# EAGLE design dmx (EAGLE 5.09)
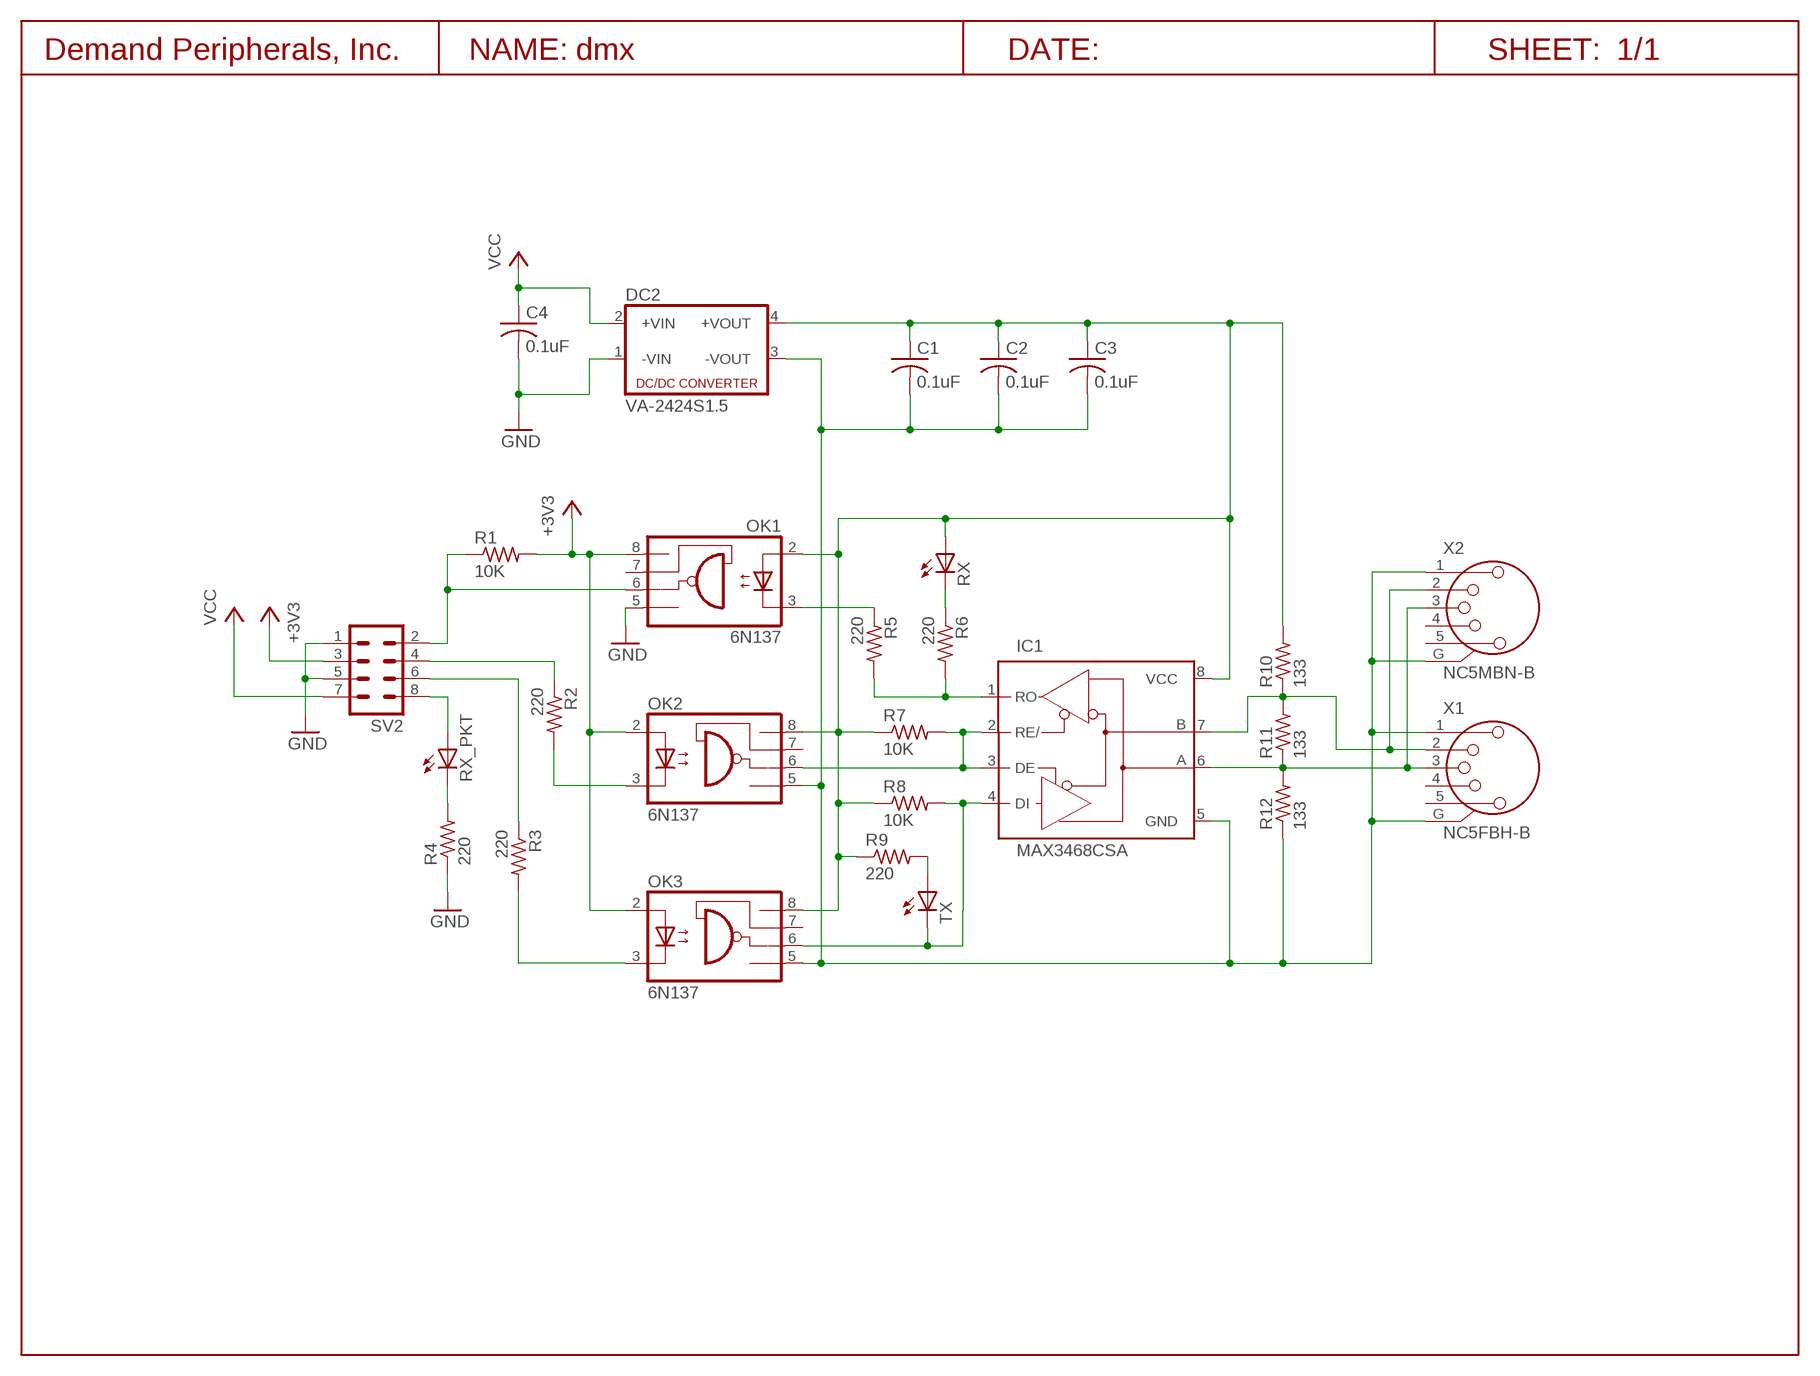
[diagram p0: schematic, sheet 1]

## Parts
C1  0.1uF  C-USC0805  [C0805]
C2  0.1uF  C-USC0805  [C0805]
C3  0.1uF  C-USC0805  [C0805]
C4  0.1uF  C-USC0805  [C0805]
DC2  VA-2424S1.5  [4SIL]
IC1  MAX3468CSA  [SO08]
OK1  6N137  HCPL0600  [SOIC08]
OK2  6N137  HCPL0600  [SOIC08]
OK3  6N137  HCPL0600  [SOIC08]
R1  10K  R-US_R0603  [R0603]
R2  220  R-US_R0603  [R0603]
R3  220  R-US_R0603  [R0603]
R4  220  R-US_R0603  [R0603]
R5  220  R-US_R0603  [R0603]
R6  220  R-US_R0603  [R0603]
R7  10K  R-US_R0603  [R0603]
R8  10K  R-US_R0603  [R0603]
R9  220  R-US_R0603  [R0603]
R10  133  R-US_R0603  [R0603]
R11  133  R-US_R0603  [R0603]
R12  133  R-US_R0603  [R0603]
RX  LEDCHIPLED_0805  [CHIPLED_0805]
RX_PKT  LEDCHIPLED_0805  [CHIPLED_0805]
SV2  MA04-2  [MA04-2]
TX  LEDCHIPLED_0805  [CHIPLED_0805]
U$1  DP_FRAME_L  [LETTER_L]
X1  NC5FBH-B  [NC5FBH-B]
X2  NC5MBN-B  [NC5MBH-B]

## Nets
+3V3: OK1.8(VCC) OK2.2(A) OK3.2(A) R1.2 SV2.3
GND: C4.2 DC2.1(-VIN) OK1.5(GND) R4.1 SV2.1 SV2.5
N$1: OK1.6(VO) R1.1 SV2.2
N$2: OK2.3(C) R2.2
N$3: R2.1 SV2.4
N$4: OK3.3(C) R3.2
N$5: IC1.1(RO) R5.2 R6.2
N$6: C1.1 C2.1 C3.1 DC2.4(+VOUT) IC1.8(VCC) OK1.2(A) OK2.8(VCC) OK3.8(VCC) R7.1 R8.1 R9.1 R10.2 RX.A
N$7: C1.2 C2.2 C3.2 DC2.3(-VOUT) IC1.5(GND) OK2.5(GND) OK3.5(GND) R12.1
N$8: IC1.2(RE/) IC1.3(DE) OK2.6(VO) R7.2
N$9: R6.1 RX.C
N$10: OK1.3(C) R5.1
N$11: R9.2 TX.A
N$13: IC1.4(DI) OK3.6(VO) R8.2 TX.C
N$14: IC1.7(B) R10.1 R11.2 X1.2 X2.2
N$15: IC1.6(A) R11.1 R12.2 X1.3 X2.3
N$16: R3.1 SV2.6
N$21: R4.2 RX_PKT.C
N$28: RX_PKT.A SV2.8
N$29: X1.1 X1.G X2.1 X2.G
VCC: C4.1 DC2.2(+VIN) SV2.7
Unconnected: OK1.7(VE) OK2.7(VE) OK3.7(VE) X1.4 X1.5 X2.4 X2.5

## Library data of the parts
C1-C4 = rcl:C-US: CAPACITOR, American symbol
DC2 = dc-dc-converter:VA-*?: DC DC Converter Single Output, 1 Watt Motien Technology Co.,Ltd. Source: va-serie.pdf
IC1 = maxim:MAX34*: +5V, Fail-Safe, 40Mbps, Profibus RS-485/RS-422 Transceivers Source: MAX3465-MAX3469.pdf
OK1-OK3 = optocoupler:HCPL0600: HEWLETT PACKARD OPTO COUPLER
R1-R12 = rcl:R-US_: RESISTOR, American symbol
RX RX_PKT TX = led:LED: LED OSRAM: - CHIPLED LG R971, LG N971, LY N971, LG Q971, LY Q971, LO R971, LY R971 LH N974, LH R974 LS Q976, LO Q976, LY Q976 LO Q996 - Hyper CHIPLED LW Q18S LB Q993, LB Q99A, LB R99A - SideLED LS A670, LO A670, LY A670, LG A670, LP A670 LB A673, LV A673, LT A673, LW A673 LH A674 LY A675 LS A676, LA A676, LO A676, LY A676, LW A676 LS A679, LY A679, LG A679 - Hyper Micro SIDELED® LS Y876, LA Y876, LO Y876, LY Y876 LT Y87S - SmartLED LW L88C, LW L88S LB L89C, LB L89S, LG L890 LS L89K, LO L89K, LY L89K LS L896, LA L896, LO L896, LY L896 - TOPLED LS T670, LO T670, LY T670, LG T670, LP T670 LSG T670, LSP T670, LSY T670, LOP T670, LYG T670 LG T671, LOG T671, LSG T671 LB T673, LV T673, LT T673, LW T673 LH T674 LS T676, LA T676, LO T676, LY T676, LB T676, LH T676, LSB T676, LW T676 LB T67C, LV T67C, LT T67C, LS T67K, LO T67K, LY T67K, LW E67C LS E67B, LA E67B, LO E67B, LY E67B, LB E67C, LV E67C, LT E67C LW T67C LS T679, LY T679, LG T679 LS T770, LO T770, LY T770, LG T770, LP T770 LB T773, LV T773, LT T773, LW T773 LH T774 LS E675, LA E675, LY E675, LS T675 LS T776, LA T776, LO T776, LY T776, LB T776 LHGB T686 LT T68C, LB T68C - Hyper Mini TOPLED® LB M676 - Mini TOPLED Santana® LG M470 LS M47K, LO M47K, LY M47K Source: http://www.osram.convergy.de LUXEON: - LUMILED® LXK2-PW12-R00, LXK2-PW12-S00, LXK2-PW14-U00, LXK2-PW14-V00 LXK2-PM12-R00, LXK2-PM12-S00, LXK2-PM14-U00 LXK2-PE12-Q00, LXK2-PE12-R00, LXK2-PE12-S00, LXK2-PE14-T00, LXK2-PE14-U00 LXK2-PB12-K00, LXK2-PB12-L00, LXK2-PB12-M00, LXK2-PB14-N00, LXK2-PB14-P00, LXK2-PB14-Q00 LXK2-PR12-L00, LXK2-PR12-M00, LXK2-PR14-Q00, LXK2-PR14-R00 LXK2-PD12-Q00, LXK2-PD12-R00, LXK2-PD12-S00 LXK2-PH12-R00, LXK2-PH12-S00 LXK2-PL12-P00, LXK2-PL12-Q00, LXK2-PL12-R00 Source: www.luxeon.com KINGBRIGHT: KA-3528ASYC Source: www.kingbright.com
SV2 = con-lstb:MA04-2: PIN HEADER
U$1 = DP:DP_FRAME_L: Landscape/Letter Document Frame
X1 X2 = con-neutrik_ag:NC5: Neutrik Audio Connector XLR SERIES Stereo 1/4" jack Source: www.neutrik.com/

## Board
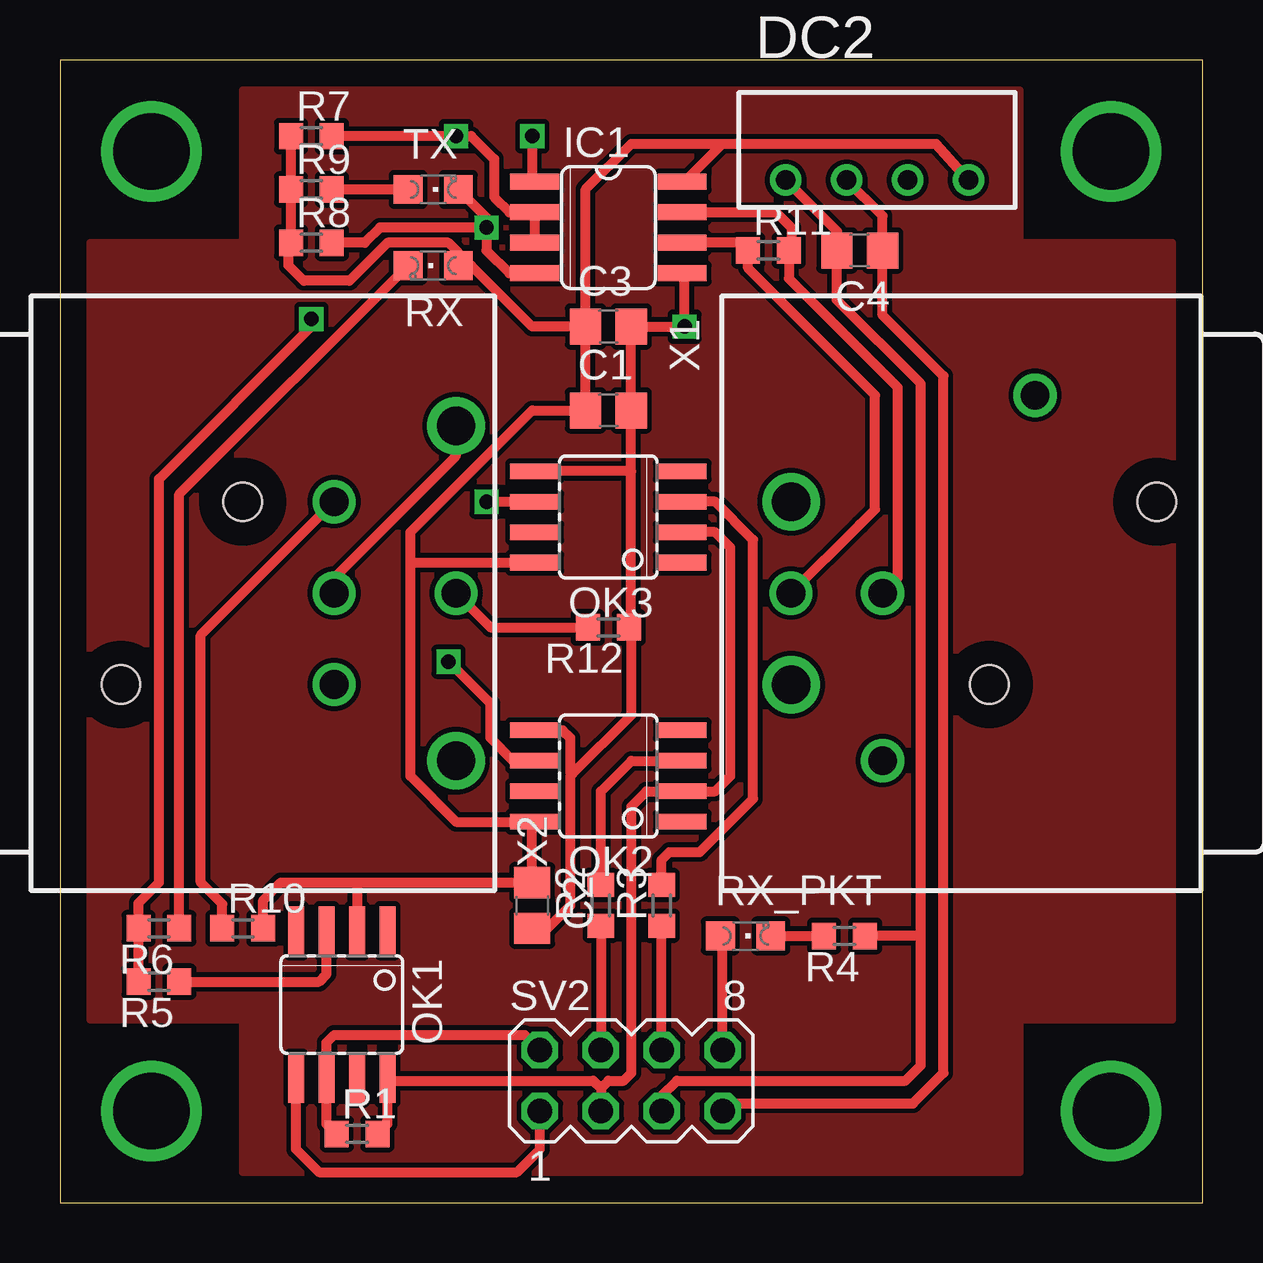
[diagram p1: board, top side]
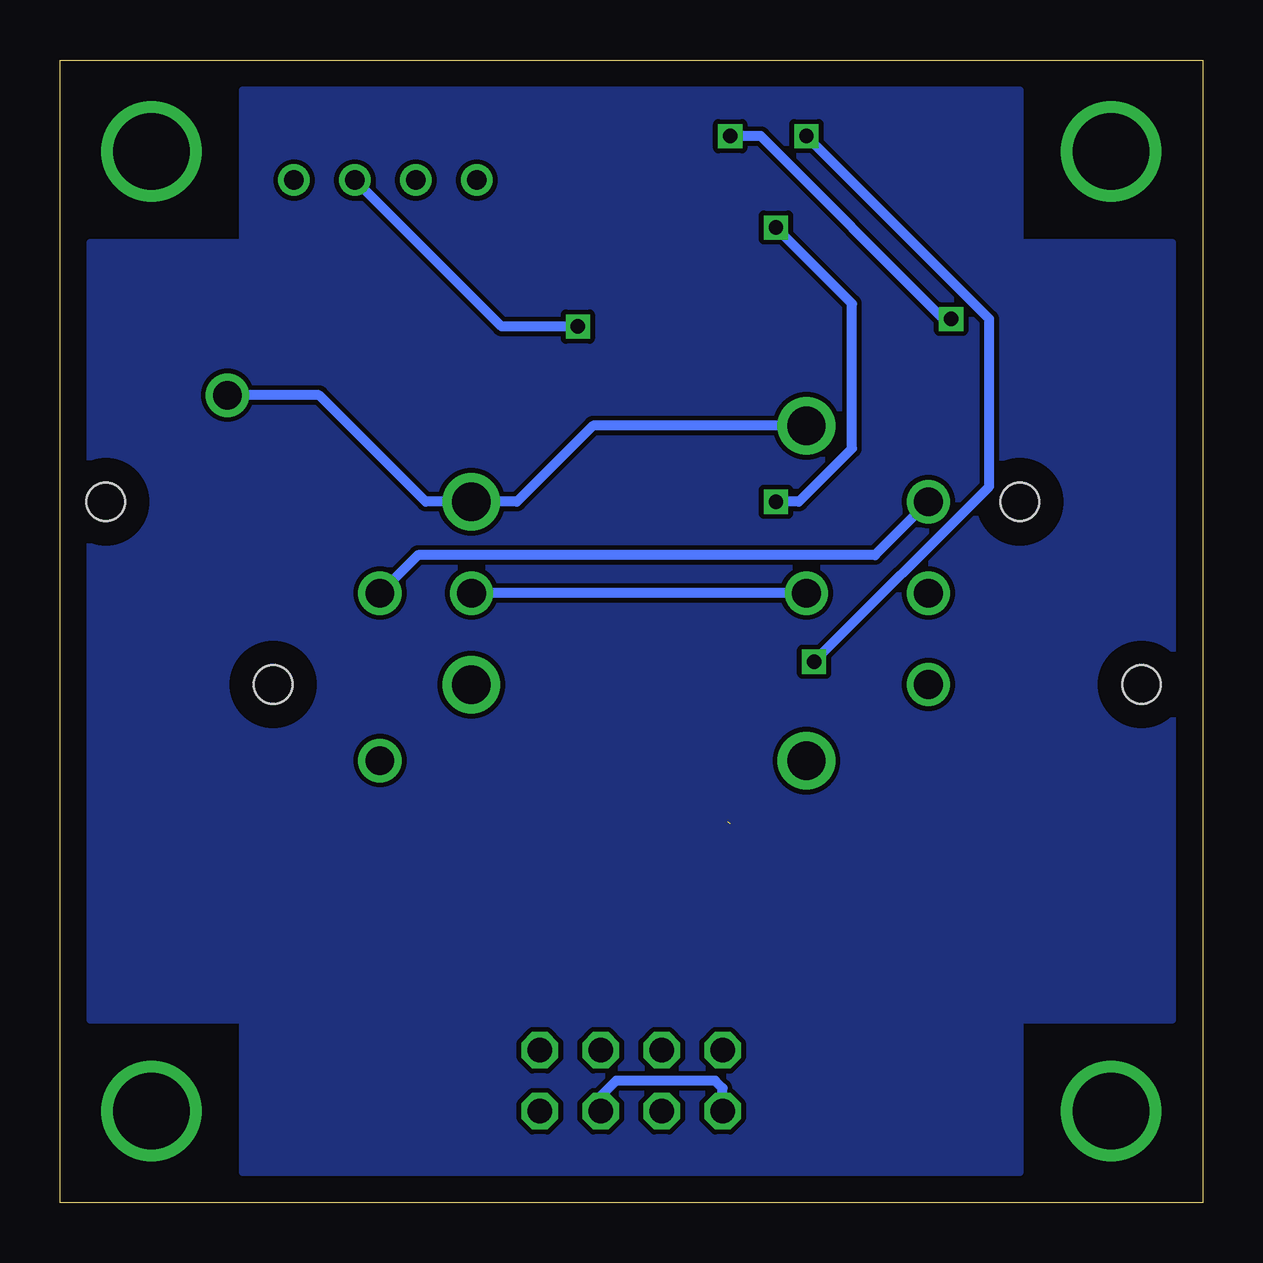
[diagram p2: board, bottom side, seen from below]

Size 47.62 x 47.62 mm. Coordinates in mm from the lower left corner, seen from the top.
Outline: 0,0 47.62,0 47.62,47.62 0,47.62 0,0
Copper layers (1*16): Top 0.035mm / dielectric 1.5mm / Bottom 0.035mm
Design rules "default": minimum track width 10mil, minimum drill 24mil, track to track 8mil, track to pad 8mil, pad to pad 8mil, via to via 8mil, smd to smd 8mil, copper to edge 40mil, drill to drill 8mil, minimum pad ring 10mil, minimum via ring 8mil, stop-mask expansion 4mil, vias tented up to drill 0mil, thermal gap 10mil
tKeepout: area 15.1,0.5 to 32.5,9.7

### Footprints (pad centres in the part's own frame; a part is rotated, then mirrored left to right if it is on the bottom)
C0805 = smd 1.3 x 1.5: 1 -0.95,0; 2 0.95,0
4SIL = drill 0.8 round: 1 -3.81,0; 2 -1.27,0; 3 1.27,0; 4 3.81,0
SO08 = smd 0.66 x 2.032: 1 -1.905,-3.073; 2 -0.635,-3.073; 3 0.635,-3.073; 4 1.905,-3.073; 5 1.905,3.073; 6 0.635,3.073; 7 -0.635,3.073; 8 -1.905,3.073
SOIC08 = smd 0.66 x 2.032: 1 -1.905,-3.073; 2 -0.635,-3.073; 3 0.635,-3.073; 4 1.905,-3.073; 5 1.905,3.073; 6 0.635,3.073; 7 -0.635,3.073; 8 -1.905,3.073
R0603 = smd 1 x 1.1: 1 -0.85,0; 2 0.85,0
CHIPLED_0805 = smd 1.2 x 1.2: A 0,-1.05; C 0,1.05
MA04-2 = drill 1.016 octagon: 1 -3.81,-1.27; 2 -3.81,1.27; 3 -1.27,-1.27; 4 -1.27,1.27; 5 1.27,-1.27; 6 1.27,1.27; 7 3.81,-1.27; 8 3.81,1.27
NC5FBH-B = drill 1.6 round: 1 -3.81,-3.815; 5 3.81,-3.815 | drill 1.2 round: 2 0,0; 3 0,-3.815; 4 6.98,0; G -8.25,6.355 | hole 1.6: 3.81,4.445; -3.81,11.43
NC5MBH-B = drill 1.6 round: 1 6.98,-5.08; 5 -6.98,-5.08 | drill 1.2 round: 2 3.81,0; 3 0,-5.08; 4 -3.81,0; G 0,0 | hole 1.6: 3.81,3.81; -3.81,8.89

### Placement (x,y rotation side)
C1  22.86,33.02 0 top
C2  19.68,12.38 270 top
C3  22.86,36.51 0 top
C4  33.34,39.69 180 top
DC2  34.06,42.62 0 top
IC1  22.86,40.64 270 top
OK1  11.75,8.26 180 top
OK2  22.86,17.78 90 top
OK3  22.86,28.57 90 top
R1  12.38,2.86 0 top
R2  22.54,12.38 90 top
R3  25.08,12.38 90 top
R4  32.7,11.11 180 top
R5  4.13,9.21 180 top
R6  4.13,11.43 180 top
R7  10.48,44.45 0 top
R8  10.48,40.01 0 top
R9  10.48,42.23 0 top
R10  7.62,11.43 0 top
R11  29.53,39.69 0 top
R12  22.86,23.97 180 top
RX  15.56,39.05 90 top
RX_PKT  28.57,11.11 270 top
SV2  23.81,5.08 0 top
TX  15.56,42.23 270 top
U$1  -10.48,-6.67 0 top  (outside the outline)
X1  34.29,25.4 270 top
X2  11.43,25.4 90 top

### Tracks (layer width: path | path; a pad name or v marks a point on that pad's centre or on a via)
+3V3
  Top 0.406: 22.54,4.76 SV2.3 | 22.54,4.76 22.86,5.08 23.5,5.08 23.81,5.4 23.81,16.51 24.45,17.14 OK2.2 27.3,17.14 27.94,17.78 27.94,27.3 27.3,27.94 OK3.2 | R1.2 13.65,3.28 OK1.8 13.75,5.08 22.23,5.08 22.54,4.76
GND
  Top 0.406: 35.88,11.11 35.88,5.71 35.24,5.08 25.72,5.08 25.08,4.45 SV2.5 | OK1.5 9.84,2.22 10.79,1.27 19.05,1.27 20,2.22 SV2.1 | 35.88,11.11 R4.1 | 35.88,11.11 35.88,34.13 32.38,37.62 C4.2 32.39,40.48 DC2.1
  Bottom 0.406: SV2.1 20,4.76 20.32,5.08 24.45,5.08 25.08,4.45 SV2.5
MOUNT  (via drill 3.17 pad 3.17)
  other vias: 3.81,43.81 43.81,43.81 3.81,3.81 43.81,3.81
N$1
  Top 0.406: R1.1 11.11,3.28 OK1.6 11.11,6.67 11.43,6.99 19.37,6.99 SV2.2
N$2
  Top 0.406: R2.2 22.54,17.14 23.81,18.41 OK2.3
N$3
  Top 0.406: R2.1 SV2.4
N$4
  Top 0.406: R3.2 25.08,14.29 25.4,14.61 26.67,14.61 28.89,16.83 28.89,27.62 27.3,29.21 OK3.3
N$5  (via drill 0.6)
  Top 0.406: IC1.1 19.68,42.65 v19.68,44.45 | R5.2 R6.2 3.28,12.48 4.13,13.34 4.13,30.16 10.48,36.51 v10.48,36.83
  Bottom 0.406: v10.48,36.83 10.79,36.83 18.41,44.45 v19.68,44.45
N$6  (1 unrouted)
  Top 0.406: IC1.8 26.04,42.55 27.62,44.13 | 27.62,44.13 36.51,44.13 37.78,42.71 DC2.4 | C3.1 C1.1 19.68,33.02 14.61,27.94 14.61,26.67 | RX.A 16.83,38.83 | C3.1 21.91,42.23 23.81,44.13 27.62,44.13 | R7.1 R9.1 R8.1 9.53,39.9 9.53,39.05 10.16,38.42 12.06,38.42 13.65,40.01 16.19,40.01 16.61,39.59 RX.A | R10.2 8.47,12.6 9.21,13.34 12.38,13.34 | C3.1 19.68,36.51 17.14,39.05 RX.A | 14.61,26.67 14.61,17.78 16.51,15.88 OK2.8 | 14.61,26.67 OK3.8 | 19.68,15.77 C2.1 12.38,13.34 | 12.38,13.34 OK1.2
N$7  (via drill 0.6)
  Top 0.406: 23.81,30.48 C1.2 C3.2 v26.04,36.51 26.04,38.63 IC1.5 | 23.81,30.48 OK3.5 | C2.2 20.32,11.43 21.27,12.38 21.27,17.78 21.35,17.86 | 23.81,30.48 23.81,24.07 R12.1 23.81,23.87 23.81,20.32 21.35,17.86 | OK2.5 20.95,19.68 21.27,19.37 21.27,17.94 21.35,17.86
  Bottom 0.406: DC2.3 29.21,36.51 v26.04,36.51
N$8  (via drill 0.6)
  Top 0.406: IC1.3 IC1.2 18.73,41.27 18.1,41.91 18.1,43.5 17.14,44.45 v16.51,44.45 R7.2 | OK2.6 18.89,18.41 17.94,19.37 17.94,20.8 v16.19,22.54
  Bottom 0.406: v16.51,44.45 8.89,36.83 8.89,29.84 v16.19,22.54
N$9
  Top 0.406: 14.29,39.05 RX.C 4.98,29.52 R6.1
N$10
  Top 0.406: OK1.3 11.11,9.53 10.79,9.21 R5.1
N$11
  Top 0.406: TX.A R9.2
N$12
  pour Bottom: 1.27,7.62 1.27,40.01 7.62,40.01 7.62,46.35 40.01,46.35 40.01,40.01 46.35,40.01 46.35,7.62 40.01,7.62 40.01,1.27 7.62,1.27 7.62,7.62
N$13  (via drill 0.6)
  Top 0.406: IC1.4 18.73,38.73 17.78,39.69 v17.78,40.64 | v17.78,29.21 OK3.6 | R8.2 12.7,40.01 13.34,40.64 v17.78,40.64 | v17.78,40.64 17.78,41.05 TX.C
  Bottom 0.406: v17.78,29.21 16.83,29.21 14.61,31.43 14.61,37.47 v17.78,40.64
N$14
  Top 0.406: IC1.7 29.84,41.27 30.48,40.64 30.48,39.79 R11.2 30.38,38.52 34.92,33.97 34.92,26.04 X1.2 | R10.1 6.77,12.44 5.87,13.34 5.87,23.65 X2.2
  Bottom 0.406: X1.2 32.7,26.99 13.65,26.99 X2.2
N$15
  Top 0.406: IC1.6 28.36,40.01 R11.1 28.68,38.95 33.97,33.66 33.97,28.89 33.34,28.26 X1.3 | R12.2 17.94,23.97 X2.3
  Bottom 0.406: X2.3 X1.3
N$16
  Top 0.406: SV2.6 R3.1
N$17
  pour Top: 1.27,7.62 1.27,40.01 7.62,40.01 7.62,46.35 40.01,46.35 40.01,40.01 46.35,40.01 46.35,7.62 40.01,7.62 40.01,1.27 7.62,1.27 7.62,7.62
N$21
  Top 0.406: RX_PKT.C R4.2
N$28
  Top 0.406: SV2.8 27.62,11.02 RX_PKT.A
N$29
  Top 0.406: X2.G 11.43,26.04 16.51,31.11 X2.1
  Bottom 0.406: X2.1 25.4,32.38 28.57,29.21 X1.1 32.38,29.21 36.83,33.66 X1.G
N$36  (via drill 0.6)
  other vias: 10.48,36.83
N$37  (via drill 0.6)
  other vias: 19.68,44.45
N$39  (via drill 0.6)
  other vias: 26.04,36.51
N$41  (via drill 0.6)
  other vias: 16.19,22.54
N$42  (via drill 0.6)
  other vias: 17.78,29.21
N$44  (via drill 0.6)
  other vias: 17.78,40.64
VCC
  Top 0.406: SV2.7 27.94,4.13 35.56,4.13 36.83,5.4 36.83,34.45 34.29,36.99 C4.1 34.29,41.12 DC2.2

### Text on the board
tTest: Gnd | V2 | V3 | 5.0V | V2 | 3.3V | Gnd | V3 | (C) 2012, Demand Peripherals, Inc. | IC1 | IC2 | IC3 | IC4 | R1 | R2 | R3 | R4 | C1 | C2 | C3 | C4 | 1 | 16 | PROTO, Rev A | 2 | 15 | 3 | 14 | 4 | 13 | 5 | 12 | 6 | 11 | 7 | 10 | 8 | BB4 | 9